# EAGLE design supply (EAGLE 7.4.0)
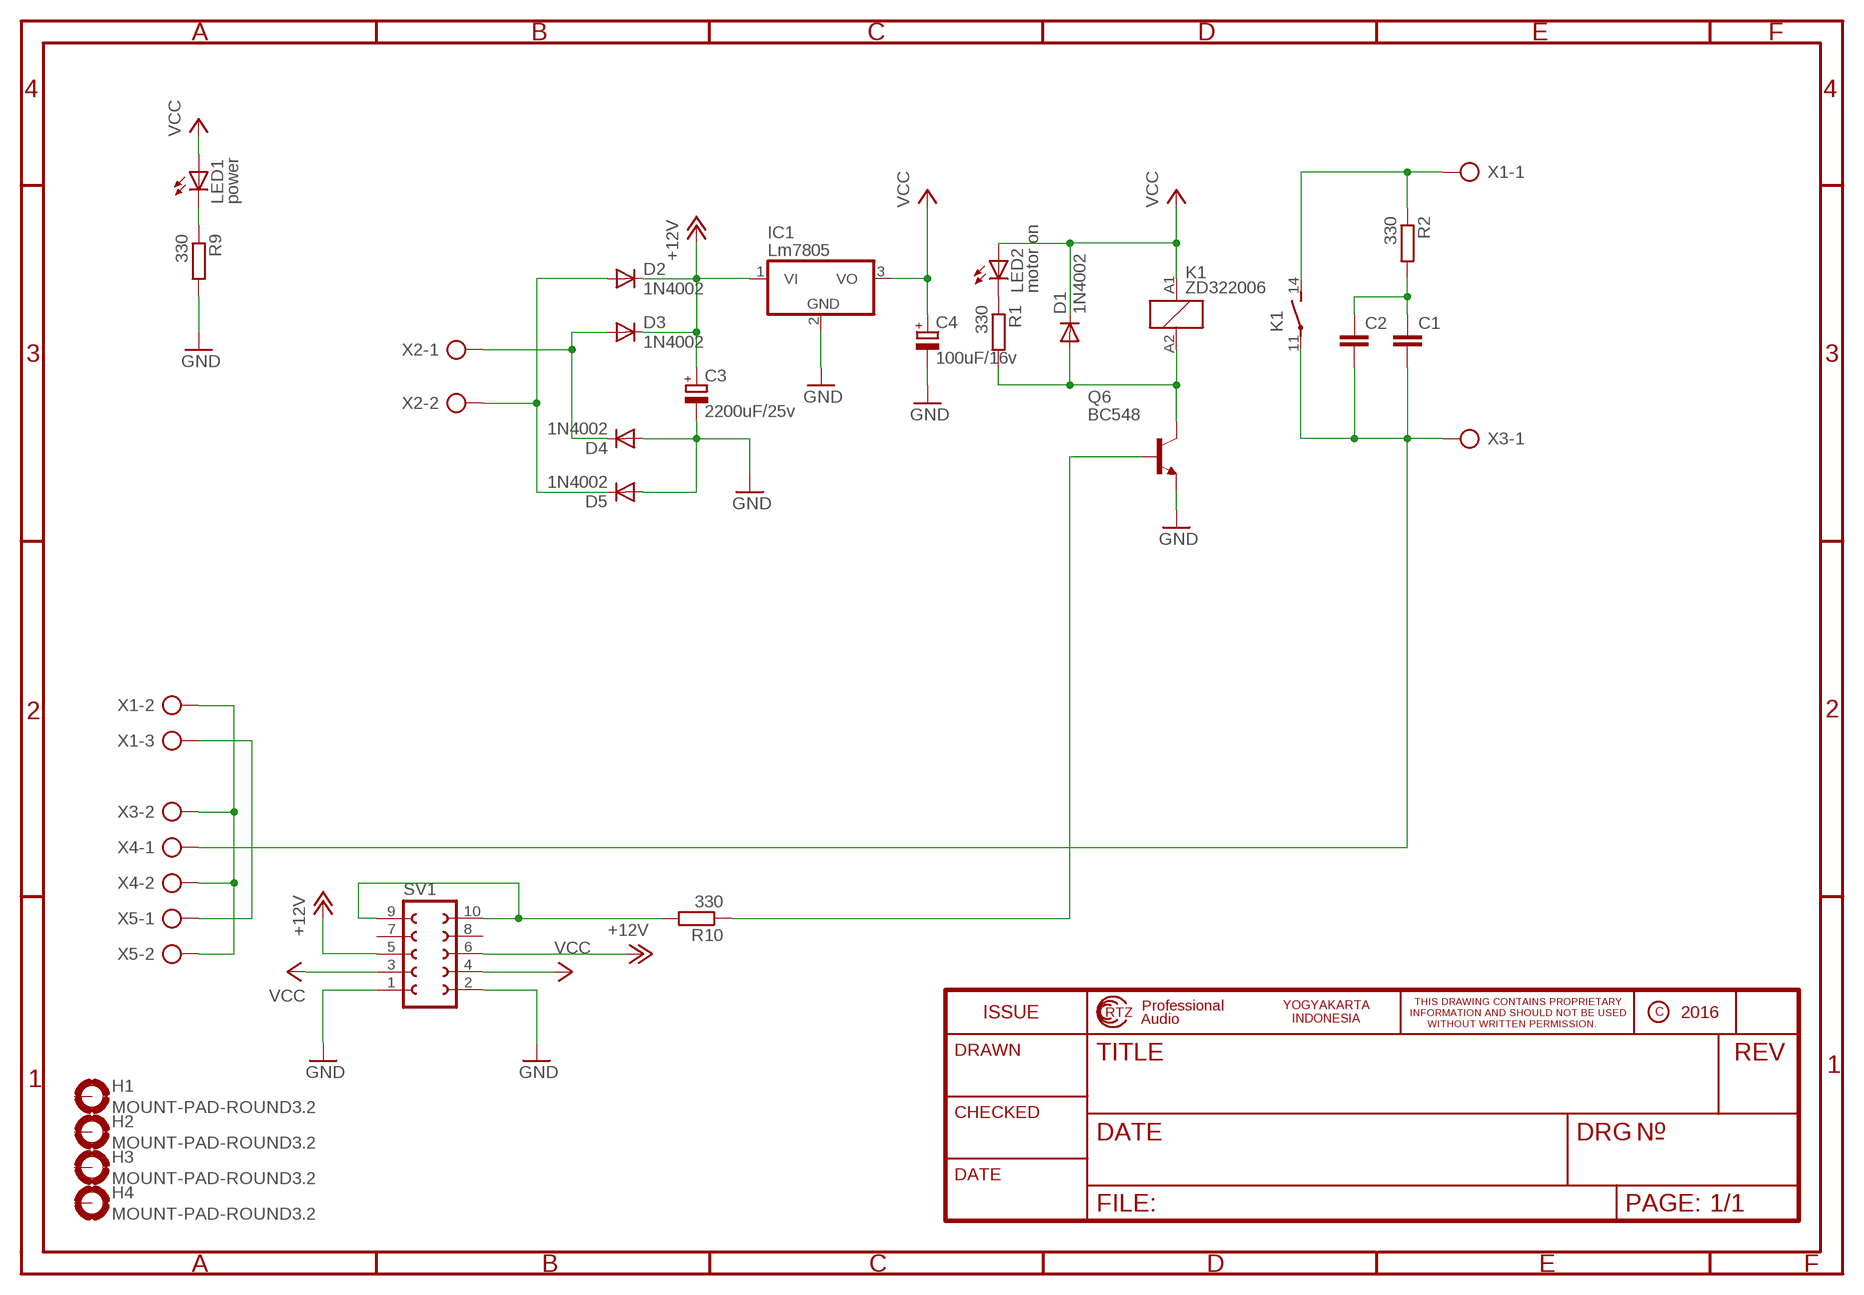
[diagram p0: schematic, sheet 1]

## Parts
C1  C-EU150-084X183  [C150-084X183]
C2  C-EU102-043X133  [C102-043X133]
C3  2200uF/25v  CPOL-EUE5-8.5  [E5-8,5]
C4  100uF/16v  CPOL-EUB45181B  [B45181B]
D1  1N4002  1N4446  [DO35-10]
D2  1N4002  1N4446  [DO35-10]
D3  1N4002  1N4446  [DO35-10]
D4  1N4002  1N4446  [DO35-10]
D5  1N4002  1N4446  [DO35-10]
H1  MOUNT-PAD-ROUND3.2  [3,2-PAD]
H2  MOUNT-PAD-ROUND3.2  [3,2-PAD]
H3  MOUNT-PAD-ROUND3.2  [3,2-PAD]
H4  MOUNT-PAD-ROUND3.2  [3,2-PAD]
IC1  Lm7805  7815TV  [TO220V]
K1  ZD322006  [ZD2]
LED1  power  LED5MM  [LED5MM]
LED2  motor on  LED5MM  [LED5MM]
Q6  BC548  [TO92-EBC]
R1  330  R-EU_0207/7  [0207/7]
R2  330  R-EU_0207/7  [0207/7]
R9  330  R-EU_0207/7  [0207/7]
R10  330  R-EU_0207/7  [0207/7]
SV1  FE05-2  [FE05-2]
X1  AK500/3  [AK500/3]
X2  AK500/2  [AK500/2]
X3  AK500/2  [AK500/2]
X4  AK500/2  [AK500/2]
X5  AK500/2  [AK500/2]

## Nets
+12V: C3.+ D2.C D3.C IC1.1(VI) SV1.5 SV1.6
GND: C3.- C4.- D4.A D5.A IC1.2(GND) Q6.E R9.2 SV1.1 SV1.2
GND1: D1.A K1.A2 Q6.C R1.2
N$1: LED2.K(C) R1.1
N$2: LED1.K(C) R9.1
N$3: D3.A D4.C X2.1
N$4: D2.A D5.C X2.2
N$5: C1.1 C2.1 R2.2
N$6: C1.2 C2.2 K1.11(2:P) X3.1 X4.1
N$7: K1.14(2:S) R2.1 X1.1
N$8: X1.2 X3.2 X4.2 X5.2
N$9: X1.3 X5.1
N$17: R10.2 SV1.9 SV1.10
N$19: Q6.B R10.1
VCC: C4.+ D1.C IC1.3(VO) K1.A1 LED1.A LED2.A SV1.3 SV1.4
Unconnected: H1.B3,2(MOUNT) H2.B3,2(MOUNT) H3.B3,2(MOUNT) H4.B3,2(MOUNT) SV1.7 SV1.8

## Library data of the parts
C1 C2 = rcl:C-EU: CAPACITOR, European symbol
C3 C4 = rcl:CPOL-EU: POLARIZED CAPACITOR, European symbol
D1-D5 = diode:1N4446: DIODE high speed (Philips)
H1-H4 = holes:MOUNT-PAD-ROUND: MOUNTING PAD, round
IC1 = linear:78*: Positive VOLTAGE REGULATOR Source: http://cache.national.com/ds/LM/LM78L05.pdf http://www.fairchildsemi.com/ds/LM/LM7805.pdf
K1 = relay:ZD?2*: Power Relay SCHRACK 1 pole 30 A Source: http://www.schrack.com/.. 5848.pdf; OC_FARNELL: unknown; OC_NEWARK: unknown
LED1 LED2 = led:LED: LED OSRAM: - CHIPLED LG R971, LG N971, LY N971, LG Q971, LY Q971, LO R971, LY R971 LH N974, LH R974 LS Q976, LO Q976, LY Q976 LO Q996 - Hyper CHIPLED LW Q18S LB Q993, LB Q99A, LB R99A - SideLED LS A670, LO A670, LY A670, LG A670, LP A670 LB A673, LV A673, LT A673, LW A673 LH A674 LY A675 LS A676, LA A676, LO A676, LY A676, LW A676 LS A679, LY A679, LG A679 - Hyper Micro SIDELED® LS Y876, LA Y876, LO Y876, LY Y876 LT Y87S - SmartLED LW L88C, LW L88S LB L89C, LB L89S, LG L890 LS L89K, LO L89K, LY L89K LS L896, LA L896, LO L896, LY L896 - TOPLED LS T670, LO T670, LY T670, LG T670, LP T670 LSG T670, LSP T670, LSY T670, LOP T670, LYG T670 LG T671, LOG T671, LSG T671 LB T673, LV T673, LT T673, LW T673 LH T674 LS T676, LA T676, LO T676, LY T676, LB T676, LH T676, LSB T676, LW T676 LB T67C, LV T67C, LT T67C, LS T67K, LO T67K, LY T67K, LW E67C LS E67B, LA E67B, LO E67B, LY E67B, LB E67C, LV E67C, LT E67C LW T67C LS T679, LY T679, LG T679 LS T770, LO T770, LY T770, LG T770, LP T770 LB T773, LV T773, LT T773, LW T773 LH T774 LS E675, LA E675, LY E675, LS T675 LS T776, LA T776, LO T776, LY T776, LB T776 LHGB T686 LT T68C, LB T68C - Hyper Mini TOPLED® LB M676 - Mini TOPLED Santana® LG M470 LS M47K, LO M47K, LY M47K Source: http://www.osram.convergy.de LUXEON: - LUMILED® LXK2-PW12-R00, LXK2-PW12-S00, LXK2-PW14-U00, LXK2-PW14-V00 LXK2-PM12-R00, LXK2-PM12-S00, LXK2-PM14-U00 LXK2-PE12-Q00, LXK2-PE12-R00, LXK2-PE12-S00, LXK2-PE14-T00, LXK2-PE14-U00 LXK2-PB12-K00, LXK2-PB12-L00, LXK2-PB12-M00, LXK2-PB14-N00, LXK2-PB14-P00, LXK2-PB14-Q00 LXK2-PR12-L00, LXK2-PR12-M00, LXK2-PR14-Q00, LXK2-PR14-R00 LXK2-PD12-Q00, LXK2-PD12-R00, LXK2-PD12-S00 LXK2-PH12-R00, LXK2-PH12-S00 LXK2-PL12-P00, LXK2-PL12-Q00, LXK2-PL12-R00 Source: www.luxeon.com KINGBRIGHT: KA-3528ASYC Source: www.kingbright.com
Q6 = transistor-npn:BC548*: NPN Transistor
R1 R2 R9 R10 = rcl:R-EU_: RESISTOR, European symbol
SV1 = con-lsta:FE05-2: FEMALE HEADER; OC_FARNELL: unknown; OC_NEWARK: unknown
X1 = con-ptr500:AK500/3: CONNECTOR; OC_FARNELL: unknown; OC_NEWARK: unknown
X2-X5 = con-ptr500:AK500/2: CONNECTOR; OC_FARNELL: unknown; OC_NEWARK: unknown

## Board
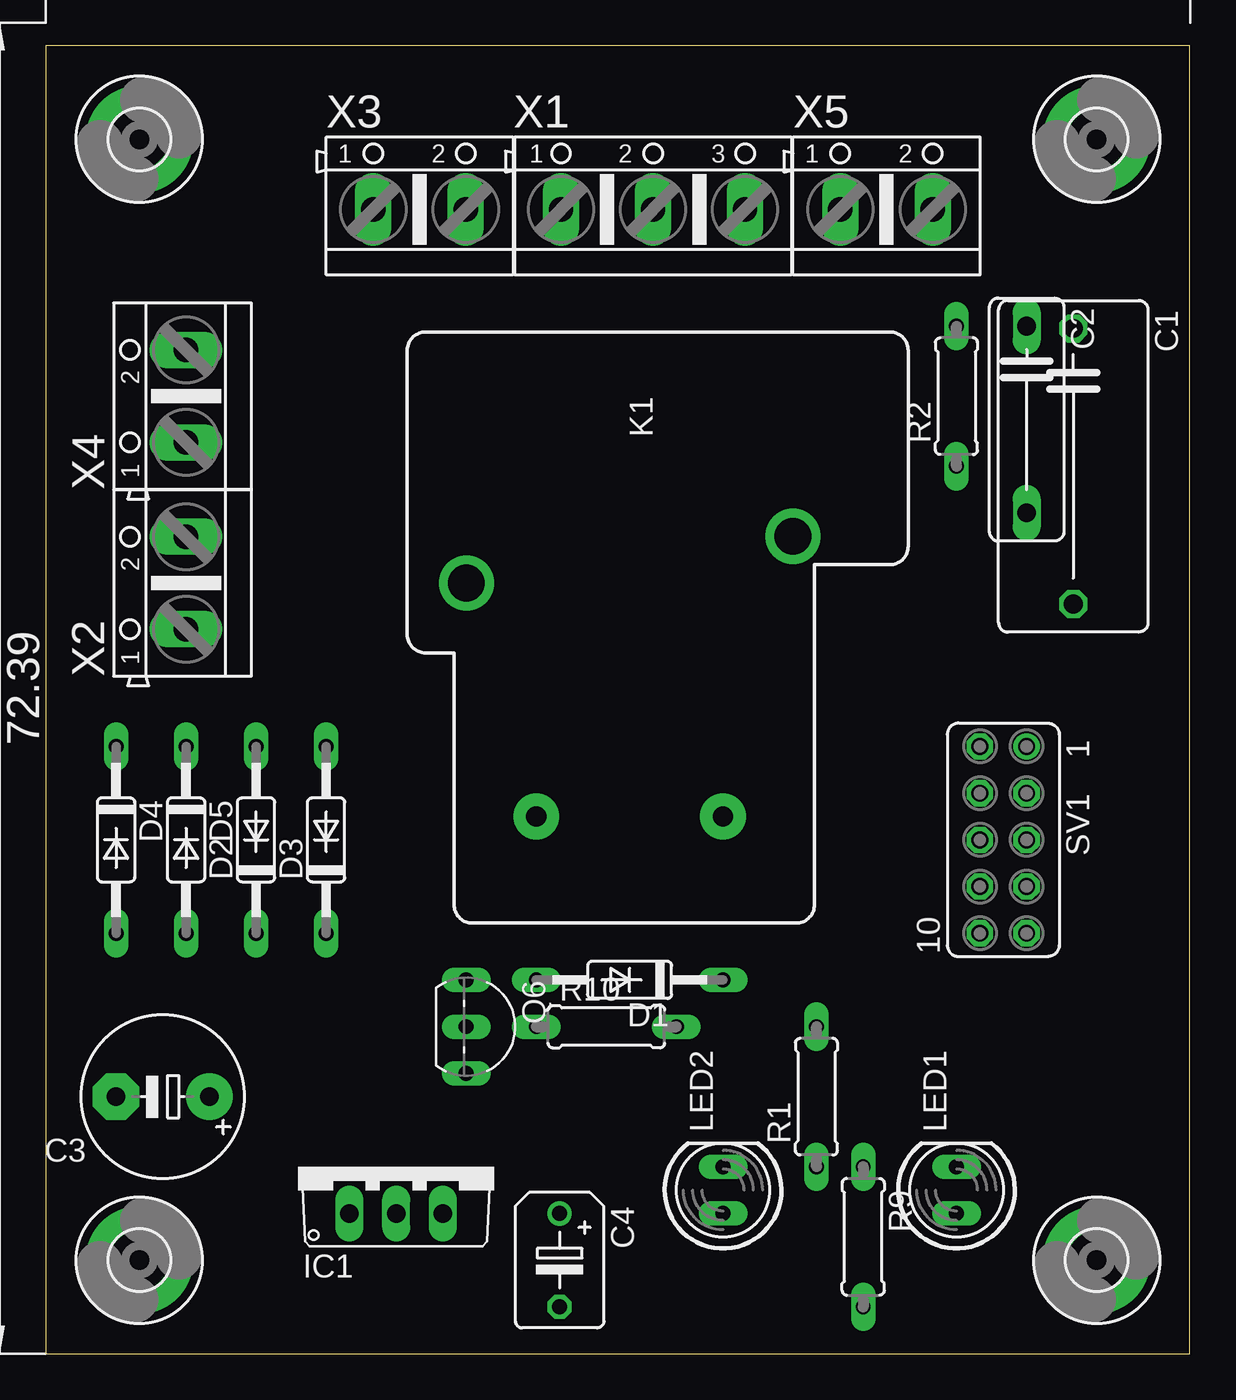
[diagram p1: board, top side]
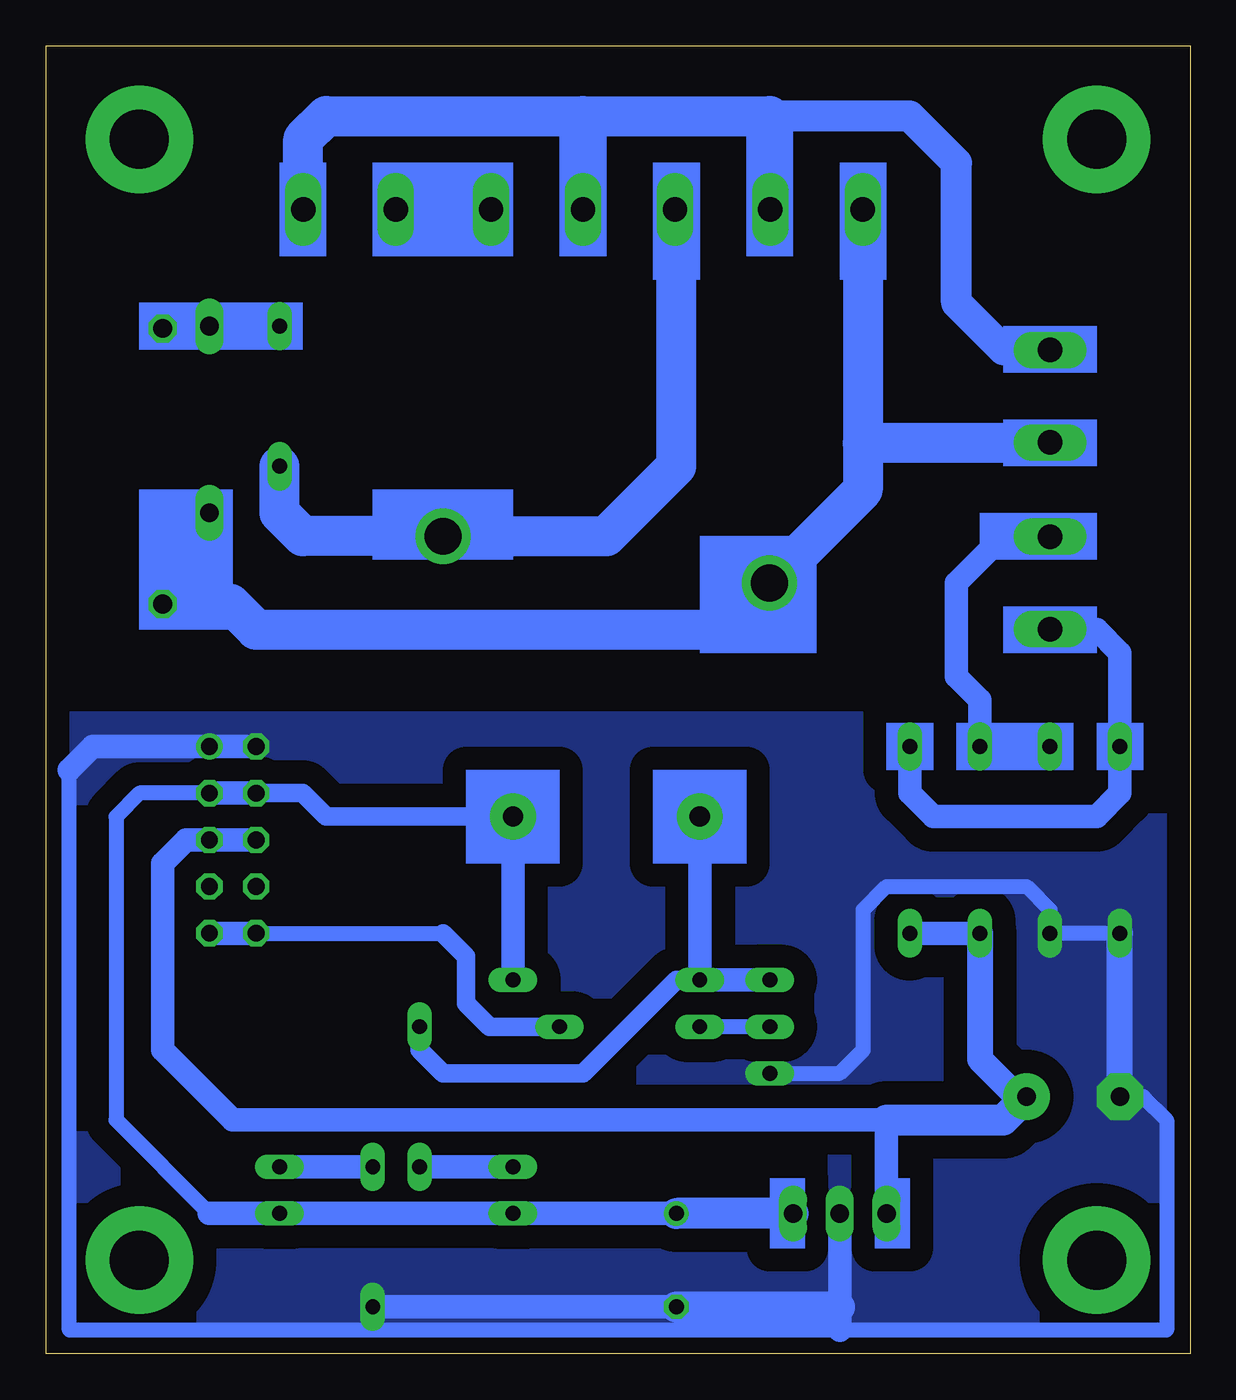
[diagram p2: board, bottom side, seen from below]

Size 62.21 x 71.12 mm. Coordinates in mm from the lower left corner, seen from the top.
Outline: 0,0 62.21,0 62.21,71.12 0,71.12 0,0
Copper layers (1*16): Top 0.035mm / dielectric 1.5mm / Bottom 0.035mm
Design rules "default": minimum track width 10mil, minimum drill 24mil, track to track 8mil, track to pad 8mil, pad to pad 8mil, via to via 8mil, smd to smd 8mil, copper to edge 40mil, drill to drill 8mil, minimum pad ring 10mil, minimum via ring 8mil, stop-mask expansion 4mil, vias tented up to drill 0mil, thermal gap 10mil

### Footprints (pad centres in the part's own frame; a part is rotated, then mirrored left to right if it is on the bottom)
C150-084X183 = drill 1.016 octagon: 1 -7.493,0; 2 7.493,0
C102-043X133 = drill 1.016 long: 1 -5.08,0; 2 5.08,0
E5-8,5 = drill 1.016 pad 2.54: + -2.54,0 | drill 1.016 pad 2.54 octagon: - 2.54,0
B45181B = drill 0.813: + -2.54,0 | drill 0.813 octagon: - 2.54,0
DO35-10 = drill 0.813 long: A 5.08,0; C -5.08,0
3,2-PAD = drill 3.2 pad 5.842: B3,2 0,0
TO220V = drill 1.016 long: 1 -2.54,-2.54; 2 0,-2.54; 3 2.54,-2.54
ZD2 = drill 2 pad 2.5: 11 -2.54,-8.88; 14 -5.08,8.88 | drill 1.1 pad 2.5: A1 10.16,5.08; A2 10.16,-5.08
LED5MM = drill 0.813 long: A -1.27,0; K 1.27,0
TO92-EBC = drill 0.813 long: B 0,-1.27; C -2.54,-1.27; E 2.54,-1.27
0207/7 = drill 0.813 long: 1 -3.81,0; 2 3.81,0
FE05-2 = drill 0.914: 1 -5.08,1.27 | drill 0.914 octagon: 2 -5.08,-1.27; 3 -2.54,1.27; 4 -2.54,-1.27; 5 0,1.27; 6 0,-1.27; 7 2.54,1.27; 8 2.54,-1.27; 9 5.08,1.27; 10 5.08,-1.27
AK500/3 = drill 1.321 long: 1 -5.004,0; 2 0,0; 3 5.004,0
AK500/2 = drill 1.321 long: 1 -2.515,0; 2 2.515,0

### Placement (x,y rotation side)
C1  55.88,48.26 270 top
C2  53.34,50.8 270 top
C3  6.35,13.97 180 top
C4  27.94,5.08 270 top
D1  31.75,20.32 180 top
D2  11.43,27.94 90 top
D3  15.24,27.94 90 top
D4  3.81,27.94 270 top
D5  7.62,27.94 270 top
H1  5.08,5.08 0 top
H2  57.15,5.08 0 top
H3  5.08,66.04 0 top
H4  57.15,66.04 0 top
IC1  19.05,10.16 0 top
K1  31.75,39.37 270 top
LED1  49.53,8.89 90 top
LED2  36.83,8.89 90 top
Q6  24.13,17.78 270 top
R1  41.91,13.97 90 top
R2  49.53,52.07 90 top
R9  44.45,6.35 270 top
R10  30.48,17.78 0 top
SV1  52.07,27.94 270 top
X1  33.02,62.23 0 top
X2  7.62,41.91 90 top
X3  20.32,62.23 0 top
X4  7.62,52.07 90 top
X5  45.72,62.23 0 top

### Tracks (layer width: path | path; a pad name or v marks a point on that pad's centre or on a via)
+12V
  Bottom 1.27: C3.+ 9.4,13.97 | D3.C D2.C | SV1.6 SV1.5 54.61,27.94 55.88,26.67 55.88,16.51 52.07,12.7 16.51,12.7 IC1.1
  Bottom 1.422: D2.C 11.43,16 9.4,13.97
  Bottom 1.676: 16.51,12.7 10.16,12.7 C3.+
GND
  Bottom 0.813: 60.96,31.75 60.96,1.27 19.05,1.27 1.27,1.27 1.27,12.7 2.54,13.97 C3.- | D4.A D5.A 7.62,24.13 8.89,25.4 16.51,25.4 17.78,24.13 17.78,16.51 19.05,15.24 Q6.E
  Bottom 1.27: SV1.2 SV1.1 59.69,33.02 60.96,31.75 | IC1.2 19.05,2.54 19.05,1.27 | R9.2 C4.-
  Bottom 1.422: C3.- D4.A
  Bottom 1.676: C4.- 19.05,2.54
  pour Bottom (isolate 1.27, no thermals): 0,34.29 62.23,34.29 62.23,0 0,0
GND1
  Bottom 1.016: D1.A 27.94,20.32 33.02,15.24 40.64,15.24 41.91,16.51 R1.2
  Bottom 1.27: K1.A2 D1.A Q6.C
N$1
  Bottom 1.27: LED2.K R1.1
N$2
  Bottom 1.27: R9.1 LED1.K
N$3
  Bottom 1.27: X2.1 7.59,39.37 5.08,39.37 3.81,38.1 D4.C 3.81,30.48 5.08,29.21 13.97,29.21 15.24,30.48 D3.A
N$4
  Bottom 1.27: X2.2 7.64,44.45 10.16,44.45 12.7,41.91 12.7,36.83 11.43,35.56 D2.A D5.C
N$5
  Bottom 1.27: C2.1 55.75,55.88 C1.1
  Bottom 2.184: C2.1 R2.2
N$6
  Bottom 1.27: 7.64,49.53 X4.1
  Bottom 2.184: X3.1 17.8,49.52 | 17.8,49.52 17.8,46.97 K1.11 25.41,39.37 50.8,39.37 52.2,40.77 53.34,40.77 | 7.64,49.53 17.79,49.53 17.8,49.52 | C1.2 53.34,40.77 | C2.2 53.34,40.77
N$7
  Bottom 2.184: X1.1 27.94,62.15 27.94,48.26 31.75,44.45 K1.14 48.26,44.45 49.53,45.72 R2.1
N$8
  Bottom 1.676: X4.2 10.13,54.59 12.7,57.15 12.7,64.77 15.24,67.31 22.86,67.31
  Bottom 2.184: X5.2 48.23,66.06 46.99,67.31 33.02,67.31 | 33.02,67.31 22.86,67.31 22.84,67.28 X3.2 | X1.2 33.02,67.31
N$9
  Bottom 2.184: X1.3 X5.1
N$17
  Bottom 0.813: SV1.10 40.64,22.86
  Bottom 1.016: 40.64,22.86 39.37,21.59 39.37,19.05 38.1,17.78 R10.2
  Bottom 1.27: SV1.9 SV1.10
N$19
  Bottom 0.813: Q6.B R10.1
VCC
  Bottom 0.813: SV1.3 57.15,30.48 58.42,29.21 58.42,12.7 53.34,7.62
  Bottom 1.016: K1.A1 46.99,29.21 48.26,30.48 SV1.4
  Bottom 1.27: 38.1,30.48 K1.A1 D1.C | SV1.3 SV1.4 | 53.34,7.62 LED1.A LED2.A C4.+
  Bottom 1.676: IC1.3 C4.+
(copper drawn outside any net)
  shapes: Bottom area x21